# EAGLE design Supplemental Power Switch System (EAGLE 8.1.0)
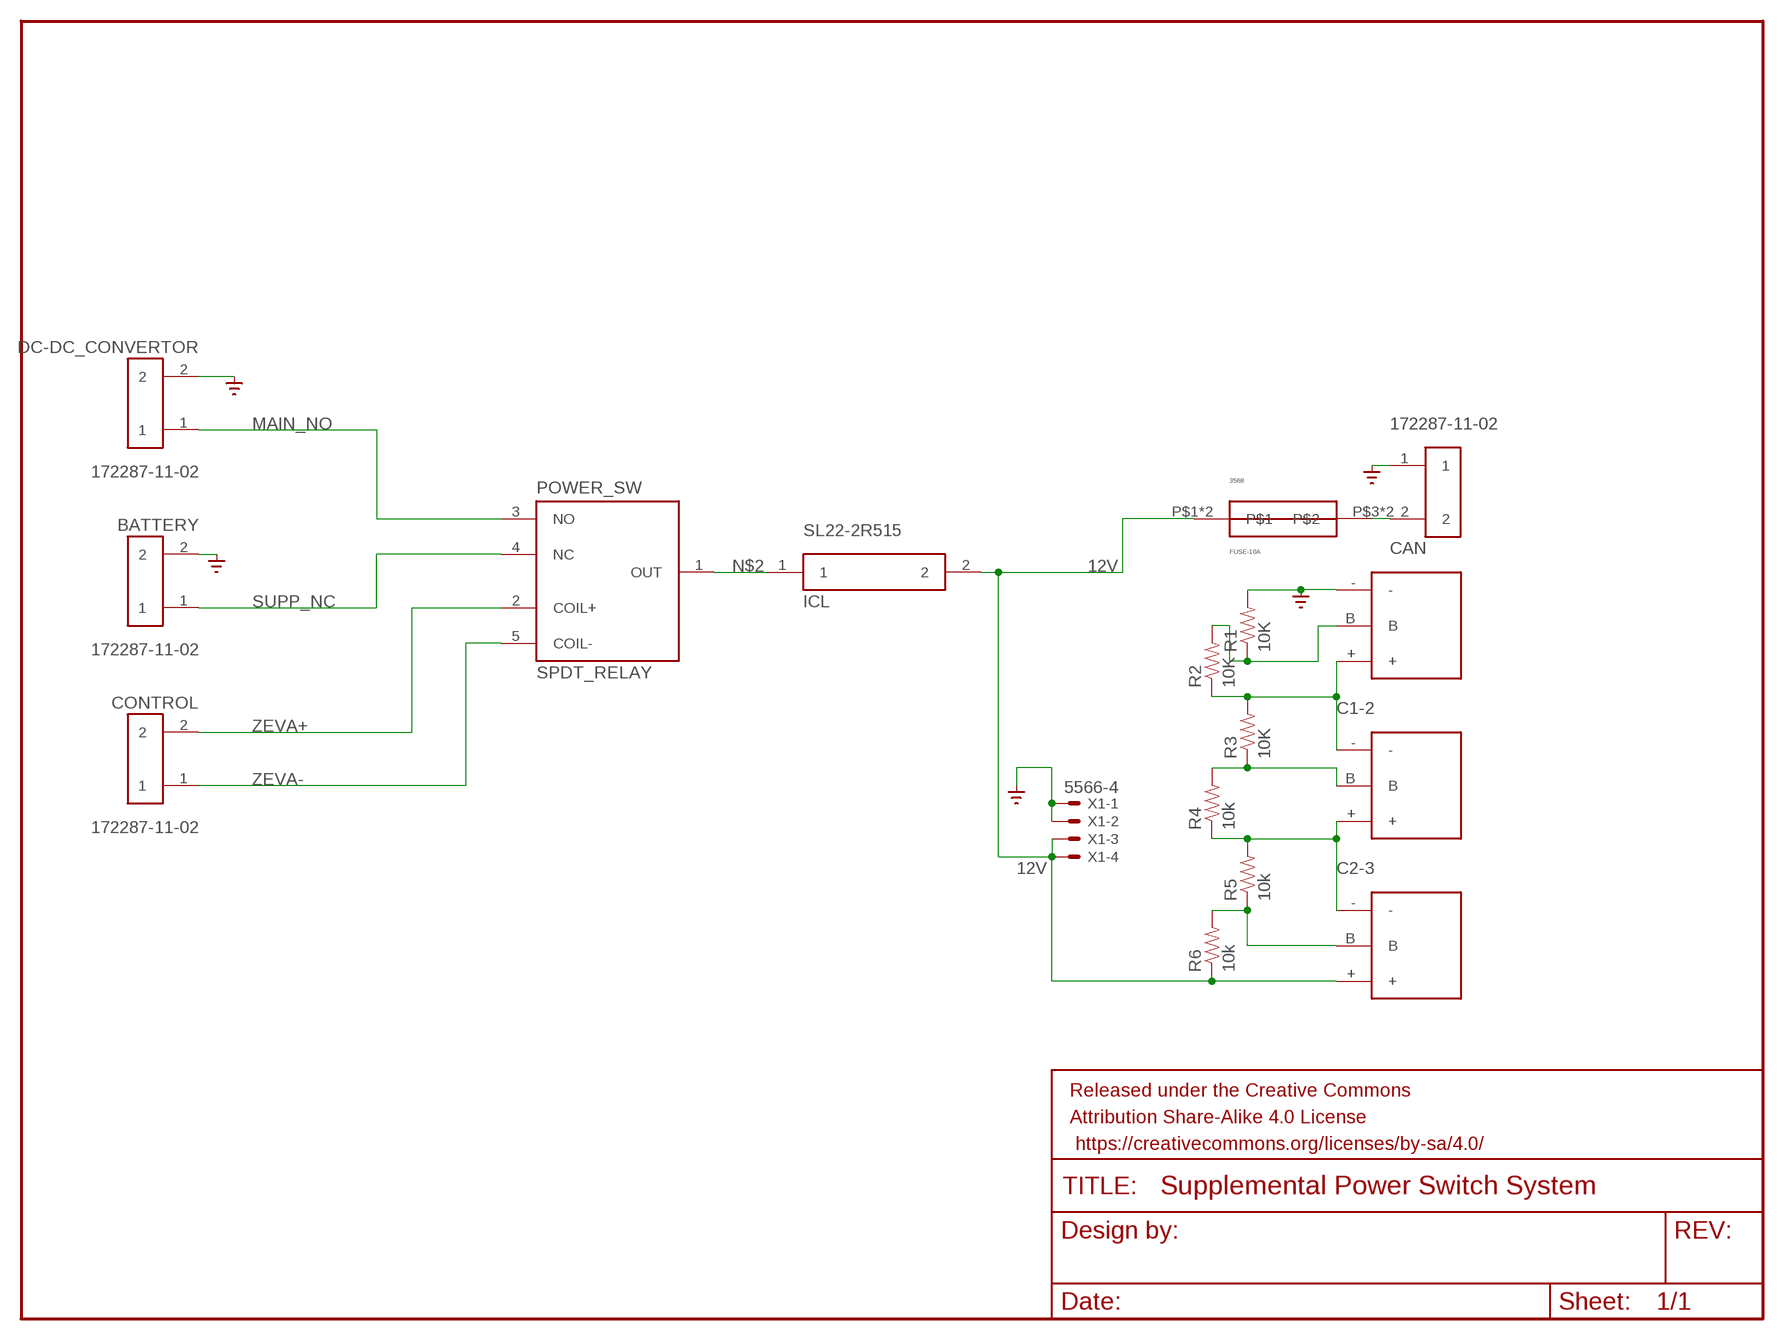
[diagram p0: schematic, sheet 1]

## Parts
BATTERY  172287-11-02  [172287-ULTRA-FIT]
C1  SUPER-CAPACITOR  [DMF]
C2  SUPER-CAPACITOR  [DMF]
C3  SUPER-CAPACITOR  [DMF]
CAN  172287-11-02  [172287-ULTRA-FIT]
CONTROL  172287-11-02  [172287-ULTRA-FIT]
DC-DC_CONVERTOR  172287-11-02  [172287-ULTRA-FIT]
FRAME1  FRAME-LETTERNO_PACKAGE  [DUMMY]
FUSE-10A  3568  [3568-MINI-297]
ICL  SL22-2R515  [SL22-2R515]
POWER_SW  SPDT_RELAY  [G8QN-1C4]
R1  10K  RESISTORPTH-1/6W  [1/6W-RES]
R2  10K  RESISTORPTH-1/6W  [1/6W-RES]
R3  10K  RESISTORPTH-1/6W  [1/6W-RES]
R4  10k  RESISTORPTH-1/6W  [1/6W-RES]
R5  10k  RESISTORPTH-1/6W  [1/6W-RES]
R6  10k  RESISTORPTH-1/6W  [1/6W-RES]
X1  5566-4  [5566-4]

## Nets
12V: C3.+ FUSE-10A.P$1 FUSE-10A.P$2 ICL.2 R6.1 X1.3 X1.4
C1-2: C1.+ C2.- R2.1 R3.2
C2-3: C2.+ C3.- R4.1 R5.2
GND: BATTERY.2 C1.- CAN.1 DC-DC_CONVERTOR.2 R1.2 X1.1 X1.2 ; supply symbol labelled GND_
MAIN_NO: DC-DC_CONVERTOR.1 POWER_SW.3(NO)
N$1: CAN.2 FUSE-10A.P$3 FUSE-10A.P$4
N$2: ICL.1 POWER_SW.1(OUT)
N$3: C3.B R5.1 R6.2
N$5: C2.B R3.1 R4.2
N$7: C1.B R1.1 R2.2
SUPP_NC: BATTERY.1 POWER_SW.4(NC)
ZEVA+: CONTROL.2 POWER_SW.2(COIL+)
ZEVA-: CONTROL.1 POWER_SW.5(COIL-)

## Library data of the parts
BATTERY CAN CONTROL DC-DC_CONVERTOR = Hooman:172287-11-02: Ultra-Fit™ 172287 Header Molex 3.5 mm pitch 2 pin connector header
C1-C3 = Hooman:SUPER-CAPACITOR: Murata Super Capacitor DMF3Z5R5H474M3DTA0
FRAME1 = SparkFun-Aesthetics:FRAME-LETTER: Schematic Frame Standard 8.5x11 US Letter frame; DESIGNER: Nobody; VERSION: v01
FUSE-10A = Hooman:3568: MINI 296 fuse holder for MINI BLADE fuse https://www.digikey.ca/products/en?FV=ffec3ba1,ffe0008c
ICL = Hooman:SL22-2R515: NTC Ametherm Inrush Current Limiter
POWER_SW = Hooman:SPDT_RELAY: SPDT Relay
R1-R6 = SparkFun-Resistors:RESISTOR: Resistor Basic schematic elements and footprints for 0603, 1206, and PTH resistors.
X1 = con-molex:5566-4: Mini FIT connector 4 pol Source: http://www.molex.com; OC_FARNELL: unknown; OC_NEWARK: unknown

## Board
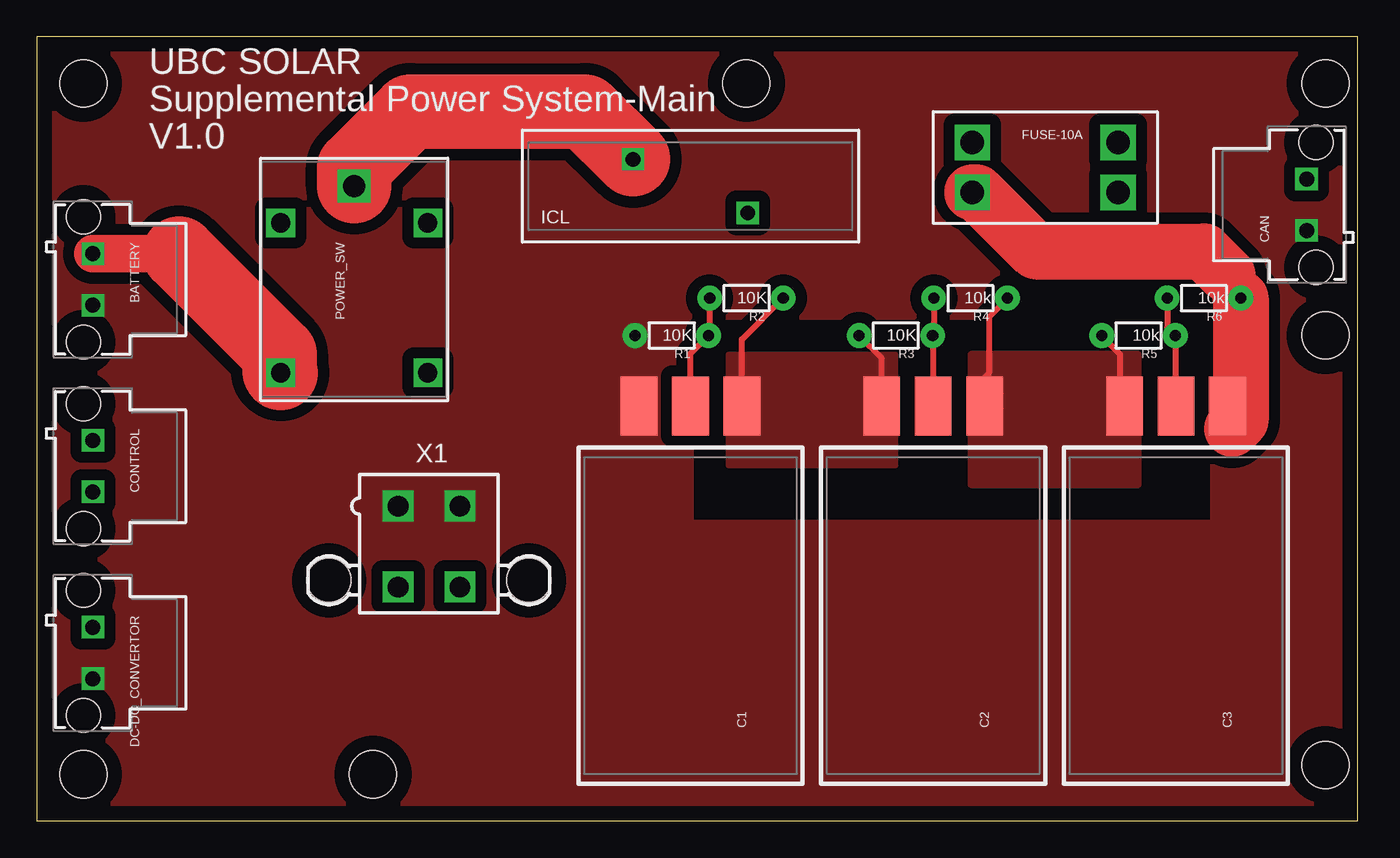
[diagram p1: board, top side]
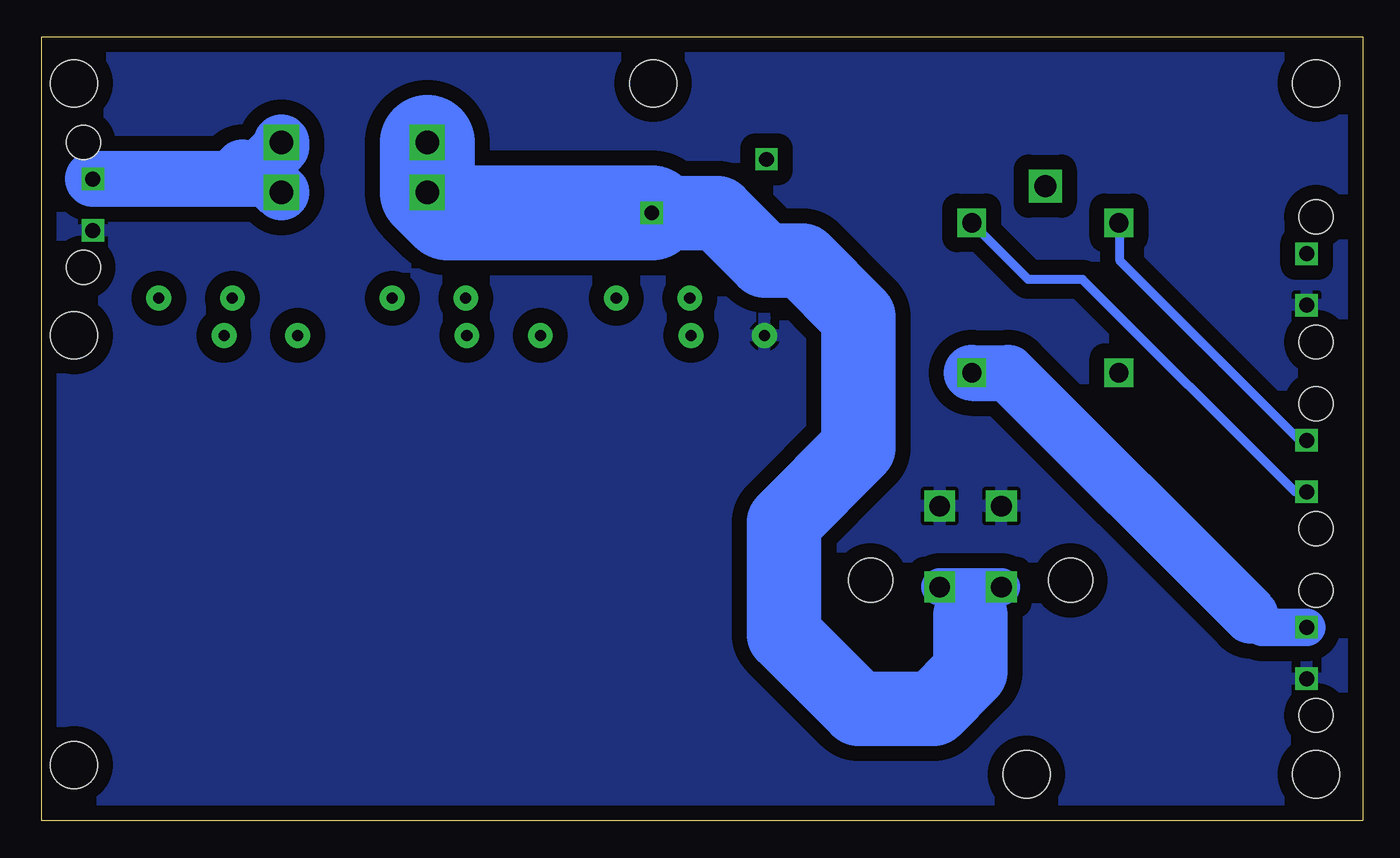
[diagram p2: board, bottom side, seen from below]

Size 89.84 x 53.33 mm. Coordinates in mm from the lower left corner, seen from the top.
Outline: 0,0 89.84,0 89.84,53.33 0,53.33 0,0
Copper layers (1*16): Top 0.035mm / dielectric 1.5mm / Bottom 0.035mm
Design rules "default": minimum track width 10mil, minimum drill 24mil, track to track 8mil, track to pad 8mil, pad to pad 8mil, via to via 8mil, smd to smd 8mil, copper to edge 40mil, drill to drill 8mil, minimum pad ring 10mil, minimum via ring 8mil, stop-mask expansion 4mil, vias tented up to drill 0mil, thermal gap 10mil
Holes 3.2 mm at 3.18,3.18 22.86,3.18 48.26,50.16 3.18,50.16 87.63,50.16 87.63,3.81 87.63,33.02
tKeepout: area 90.2,0 to 91.4,54.6; area -1.3,-1.3 to 0,54.6; area -1.3,53.3 to 91.4,54.6; area -1.3,-1.3 to 91.4,0

### Footprints (pad centres in the part's own frame; a part is rotated, then mirrored left to right if it is on the bottom)
172287-ULTRA-FIT = drill 1.02 square: 1 -1.75,0; 2 1.75,0 | hole 2.3: -4.25,-0.63; 4.25,-0.63
DMF = smd 4 x 2.5: + 14.25,-3.5; - 14.25,3.5; B 14.25,0
3568-MINI-297 = drill 1.6 square: P$1 4.96,1.7; P$2 4.96,-1.7; P$3 -4.96,1.7; P$4 -4.96,-1.7
SL22-2R515 = drill 1 square: 1 -3.9,1.825; 2 3.9,-1.825
G8QN-1C4 = drill 1.5 square: 1 -6.35,0 | drill 1.3 square: 2 -3.85,5; 3 6.35,5; 4 6.35,-5; 5 -3.85,-5
1/6W-RES = drill 0.762 pad 1.676: 1 -2.5,0; 2 2.5,0
5566-4 = drill 1.4 square: 1 2.1,-2.75; 2 -2.1,-2.75; 3 2.1,2.75; 4 -2.1,2.75 | hole 3: 6.8,2.29; -6.8,2.29

### Placement (x,y rotation side)
BATTERY  3.81,36.83 270 top
C1  44.45,13.97 90 top
C2  60.96,13.97 90 top
C3  77.47,13.97 90 top
CAN  86.36,41.91 90 top
CONTROL  3.81,24.13 270 top
DC-DC_CONVERTOR  3.81,11.43 270 top
FRAME1  -1.27,-1.27 0 top
FUSE-10A  68.58,44.45 180 top
ICL  44.45,43.18 0 top
POWER_SW  21.59,36.83 270 top
R1  43.18,33.02 180 top
R2  48.26,35.56 180 top
R3  58.42,33.02 180 top
R4  63.5,35.56 180 top
R5  74.93,33.02 180 top
R6  79.38,35.56 180 top
X1  26.67,18.66 180 top

### Tracks (layer width: path | path; a pad name or v marks a point on that pad's centre or on a via)
12V
  Top 0.406: C3.+ 80.97,34.65 R6.1 81.88,36.23 80.97,37.14
  Top 3.81: 80.97,37.14 79.38,38.73 67.95,38.73 63.93,42.75 FUSE-10A.P$1 | R6.1 81.88,27.27 81.28,26.67
  Bottom 2.184: X1.4 28.62,15.91 26.67,13.97
  Bottom 2.54: X1.3 X1.4
  Bottom 5.08: ICL.2 43.89,41.35 40.64,38.1 38.1,38.1 34.29,34.29 34.29,25.4 39.37,20.32 39.37,12.7 34.29,7.62 29.21,7.62 26.67,10.16 26.67,13.97
  Bottom 6.452: ICL.2 62.22,41.35 FUSE-10A.P$1 FUSE-10A.P$2
C1-2
  Top 0.406: C1.+ 47.95,32.75 R2.1 | C2.- 57.46,31.48 R3.2
  pour Top (isolate 0.762, no thermals): 46.99,31.75 46.99,24.13 58.42,24.13 58.42,31.75
C2-3
  Top 0.406: R4.1 66,35.52 64.77,34.29 64.77,30.48 64.46,30.17 C2.+ | R5.2 72.43,32.98 73.66,31.75 73.66,28.53 C3.-
  Top 2.54: 64.49,28.22 C2.+ 64.46,28.9
  pour Top (no thermals): 63.5,31.75 63.5,22.86 74.93,22.86 74.93,31.75
GND
  pour Bottom (isolate 1.016): 0,53.34 90.17,53.34 90.17,-1.27 0,0
  pour Top (isolate 0.762, no thermals): 0,53.34 88.9,53.34 88.9,34.29 44.45,34.29 44.45,0 0,0
  pour Top (isolate 0.762): 80.01,41.91 88.9,41.91 88.9,0 39.37,0 39.37,20.32 80.01,20.32
MAIN_NO
  Bottom 2.54: DC-DC_CONVERTOR.1 6.83,13.18 7.62,13.97
  Bottom 3.81: POWER_SW.3 24.13,30.48 7.62,13.97
N$1
  Bottom 3.81: 74.45,43.66 CAN.2 | 74.45,43.66 FUSE-10A.P$3 | FUSE-10A.P$4 73.54,45.84 74.93,44.45 75.24,44.45 | 76.2,44.45 75.24,44.45 | 75.24,44.45 74.45,43.66
N$2
  Top 5.08: POWER_SW.1 21.59,44.45 25.4,48.26 37.29,48.26 ICL.1
N$3
  Top 0.406: C3.B 77.47,32.98 R5.1 76.88,33.57 R6.2
N$5
  Top 0.406: C2.B 60.96,32.98 R3.1 61,33.1 R4.2
N$7
  Top 0.406: C1.B 44.45,31.79 R1.1 45.76,33.1 R2.2
SUPP_NC
  Top 2.54: BATTERY.1 9.68,38.58 10.16,38.1
  Top 5.08: 9.68,38.58 16.51,31.75 16.51,30.56 POWER_SW.4
ZEVA+
  Bottom 0.61: CONTROL.2 4.6,22.38 19.05,36.83 22.74,36.83 POWER_SW.2
ZEVA-
  Bottom 0.61: CONTROL.1 4.29,25.88 16.51,38.1 16.51,40.6 POWER_SW.5

### Text on the board
tPlace: UBC SOLAR | Supplemental Power System-Main | V1.0